# Altium schematic sheet 01-Power.SchDoc
size A4; SheetNumber: 1; SheetTotal: 5
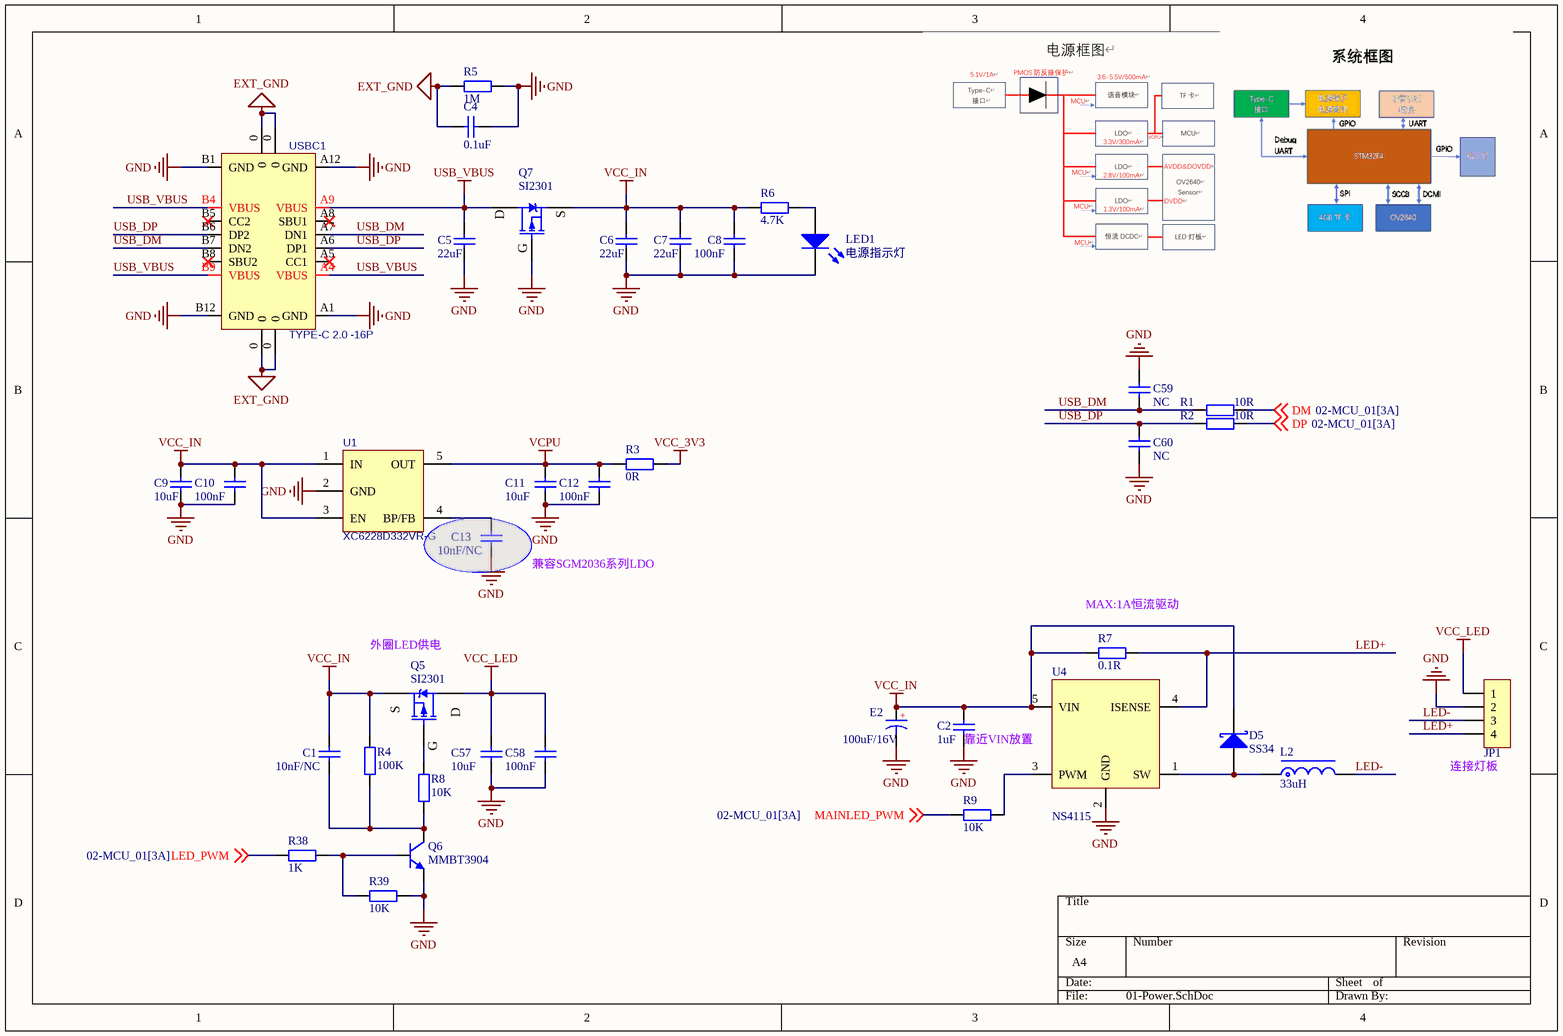
[diagram p0: 01-Power.SchDoc]

## Parts
C1  10nF/NC  [C0603_M]
C2  1uF  [C0603_M]
C4  0.1uF  [C0603_M]
C5  22uF  [C0805_M]
C6  22uF  [C0805_M]
C7  22uF  [C0805_M]
C8  100nF  [C0603_M]
C9  10uF  [C0603_M]
C10  100nF  [C0603_M]
C11  10uF  [C0603_M]
C12  100nF  [C0603_M]
C13  10nF/NC  [C0603_M]
C57  10uF  [C0603_M]
C58  100nF  [C0603_M]
C59  NC  [C0402_L]
C60  NC  [C0402_L]
D5  SS34  [SMA]
E2  100uF/16V  [CS 6*6 - B]
JP1  HDR-1X4  [MX1.25-L-4P]  (value not drawn)
L2  33uH  [CDRH74]
LED1  电源指示灯  [LED0603_G]
Q5  SI2301  [SOT23-3N]
Q6  MMBT3904  [SOT23-3N]
Q7  SI2301  [SOT23-3N]
R1  10R  [R0402_M]
R2  10R  [R0402_M]
R3  0R  [R0603_M]
R4  100K  [R0603_M]
R5  1M  [R0603_M]
R6  4.7K  [R0402_M]
R7  0.1R  [R1206_M]
R8  10K  [R0603_M]
R9  10K  [R0603_M]
R38  1K  [R0603_M]
R39  10K  [R0603_M]
U1  XC6228D332VR-G  [SOT-23-5]
U4  NS4115  [SOT89-5M]
USBC1  TYPE-C 2.0 -16P  [USB-C-SMD_16P]

## Nets
EXT_GND: C4.2 R5.2 USBC1.0
GND: C2.1 C4.1 C5.1 C6.1 C7.1 C8.1 C9.1 C10.1 C11.1 C12.1 C13.1 C57.1 C58.1 C59.2 C60.1 E2.2 JP1.2 LED1.2(K) Q6.2(E) Q7.1(G) R5.1 R39.1 U1.2(GND) U4.2(GND) USBC1.A1(GND) USBC1.A12(GND) USBC1.B1(GND) USBC1.B12(GND)
USB_VBUS: C5.2 Q7.3(D) USBC1.A4(VBUS) USBC1.A9(VBUS) USBC1.B4(VBUS) USBC1.B9(VBUS)
VCC_3V3: R3.2
VCC_IN: C1.2 C2.2 C6.2 C7.2 C8.2 C9.2 C10.2 D5.2(K) E2.1 Q5.2(S) Q7.2(S) R4.1 R6.2 R7.1 U1.1(IN) U1.3(EN) U4.5(VIN)
VCC_LED: C57.2 C58.2 JP1.1 Q5.3(D)
VCPU: C11.2 C12.2 R3.1 U1.5(OUT)
DM: R1.1 ; off-sheet DM
DP: R2.1 ; off-sheet DP
LED+: JP1.4 R7.2 U4.4(ISENSE)
LED-: JP1.3 L2.2
LED_PWM: R38.2 ; off-sheet LED_PWM
MAINLED_PWM: R9.1 ; off-sheet MAINLED_PWM
USB_DM: C59.1 R1.2 USBC1.A7(DN1) USBC1.B7(DN2)
USB_DP: C60.2 R2.2 USBC1.A6(DP1) USBC1.B6(DP2)
NetC1_1: C1.1 Q6.3(C) R4.2 R8.2
NetC13_2: C13.2 U1.4(BP/FB)
NetD5_1: D5.1(A) L2.1 U4.1(SW)
NetLED1_1: LED1.1(A) R6.1
NetQ5_1: Q5.1(G) R8.1
NetQ6_1: Q6.1(B) R38.1 R39.2
NetR9_2: R9.2 U4.3(PWM)

Not connected (* = marked no-connect by the designer): USBC1 A5(CC1)* A8(SBU1)* B5(CC2)* B8(SBU2)*

## Notes on the sheet
- 兼容SGM2036系列LDO
- (near Q5) 外圈LED供电
- (near R7) MAX:1A恒流驱动
- (near C2) 靠近VIN放置
- (near JP1) 连接灯板
- (in symbol CS_SMD) +

## Library data of the parts
C1 C2 C4-C13 C57-C60 = C: 贴片电容/MLCC电容; BOM名称: 无极性贴片电容; 当前库版本V2023.8.14 @淘宝卖家:黄晶宝石: 最新版本发布https://item.taobao.com/item.htm?id=566775463719; 联系下单店铺卖家 免费帮你查找封装: 联系下单店铺卖家 免费技术支持
  C1 C13: value: 10nF/NC
  C2: value: 1uF
  C4: value: 0.1uF
  C5-C7: value: 22uF
  C8 C10 C12 C58: value: 100nF
  C9 C11 C57: value: 10uF
  C59 C60: value: NC
D5 = SS34: 肖特基二极管; 属性: 40V/3A; 当前库版本V2023.8.14 @淘宝卖家:黄晶宝石: 最新版本发布https://item.taobao.com/item.htm?id=566775463719; BOM名称: 肖特基二极管
E2 = CS_SMD: 贴片固态电容; 联系下单店铺卖家 免费帮你查找封装: 联系下单店铺卖家 免费技术支持; BOM名称: 贴片固态电容
JP1 = Header 4: 4P连接器; 联系卖家 免费技术支持: 封装库来自淘宝卖家ID：黄晶宝石; BOM名称: 4P连接器
L2 = L-CDRH: CDRH功率屏蔽电感; BOM名称: 功率屏蔽电感; 当前库版本V2023.8.14 @淘宝卖家:黄晶宝石: 最新版本发布https://item.taobao.com/item.htm?id=566775463719; VALUE: 33uH
LED1 = LED: 贴片LED; 封装库来自淘宝卖家：黄晶宝石: 其他店铺购入均为盗版封装库，无更新权益，请立即申请退款，本店现金奖励200~1000元; BOM名称: 贴片LED
Q5 Q7 = SI2301: P沟道 20V/2.8A; BOM名称: P沟道场效应管; 联系下单店铺卖家 免费帮你查找封装: 联系下单店铺卖家 免费技术支持
Q6 = MMBT3904: 高频放大-NPN型; 参数: 40V 0.2A 0.3W 300MHZ; 联系下单店铺卖家 免费帮你查找封装: 联系下单店铺卖家 免费技术支持; BOM名称: 高频放大-NPN型
R1-R7 R9 R38 R39 = R: 贴片电阻; 联系下单店铺卖家 免费帮你查找封装: 联系下单店铺卖家 免费技术支持; BOM名称: 贴片电阻
  R1 R2: value: 10R
  R3: value: 0R
  R4: value: 100K
  R5: value: 1M
  R6: value: 4.7K
  R7: value: 0.1R
  R9 R39: value: 10K
  R38: value: 1K
R8 = R: 贴片电阻; 联系下单店铺卖家 免费帮你查找封装: 联系下单店铺卖家 免费技术支持; value: 1K; BOM名称: 贴片电阻
U1 = SGM2019-1.8YN5G: LDO 1.8V/0.3A; 当前库版本V2023.8.14 @淘宝卖家:黄晶宝石: 最新版本发布https://item.taobao.com/item.htm?id=566775463719; BOM名称: SGM2019-1.8YN5G
U4 = NS4115: NS4115 LED恒流驱动IC，最大输出电流1A，输入支持PWM调光
USBC1 = USB2.0_Type-C_16Pin: USB2.0_Type-C_16Pin母座; 联系下单店铺卖家 免费技术支持: 联系下单店铺卖家 免费帮你查找封装